# EasyEDA Pro project sfy3-v3.1.4.epro, schematic sfy3_1_2

## Sheets
1 Notecard, Antennas: Board Name: sfy3_1_2; Create Date: 2024-08-16
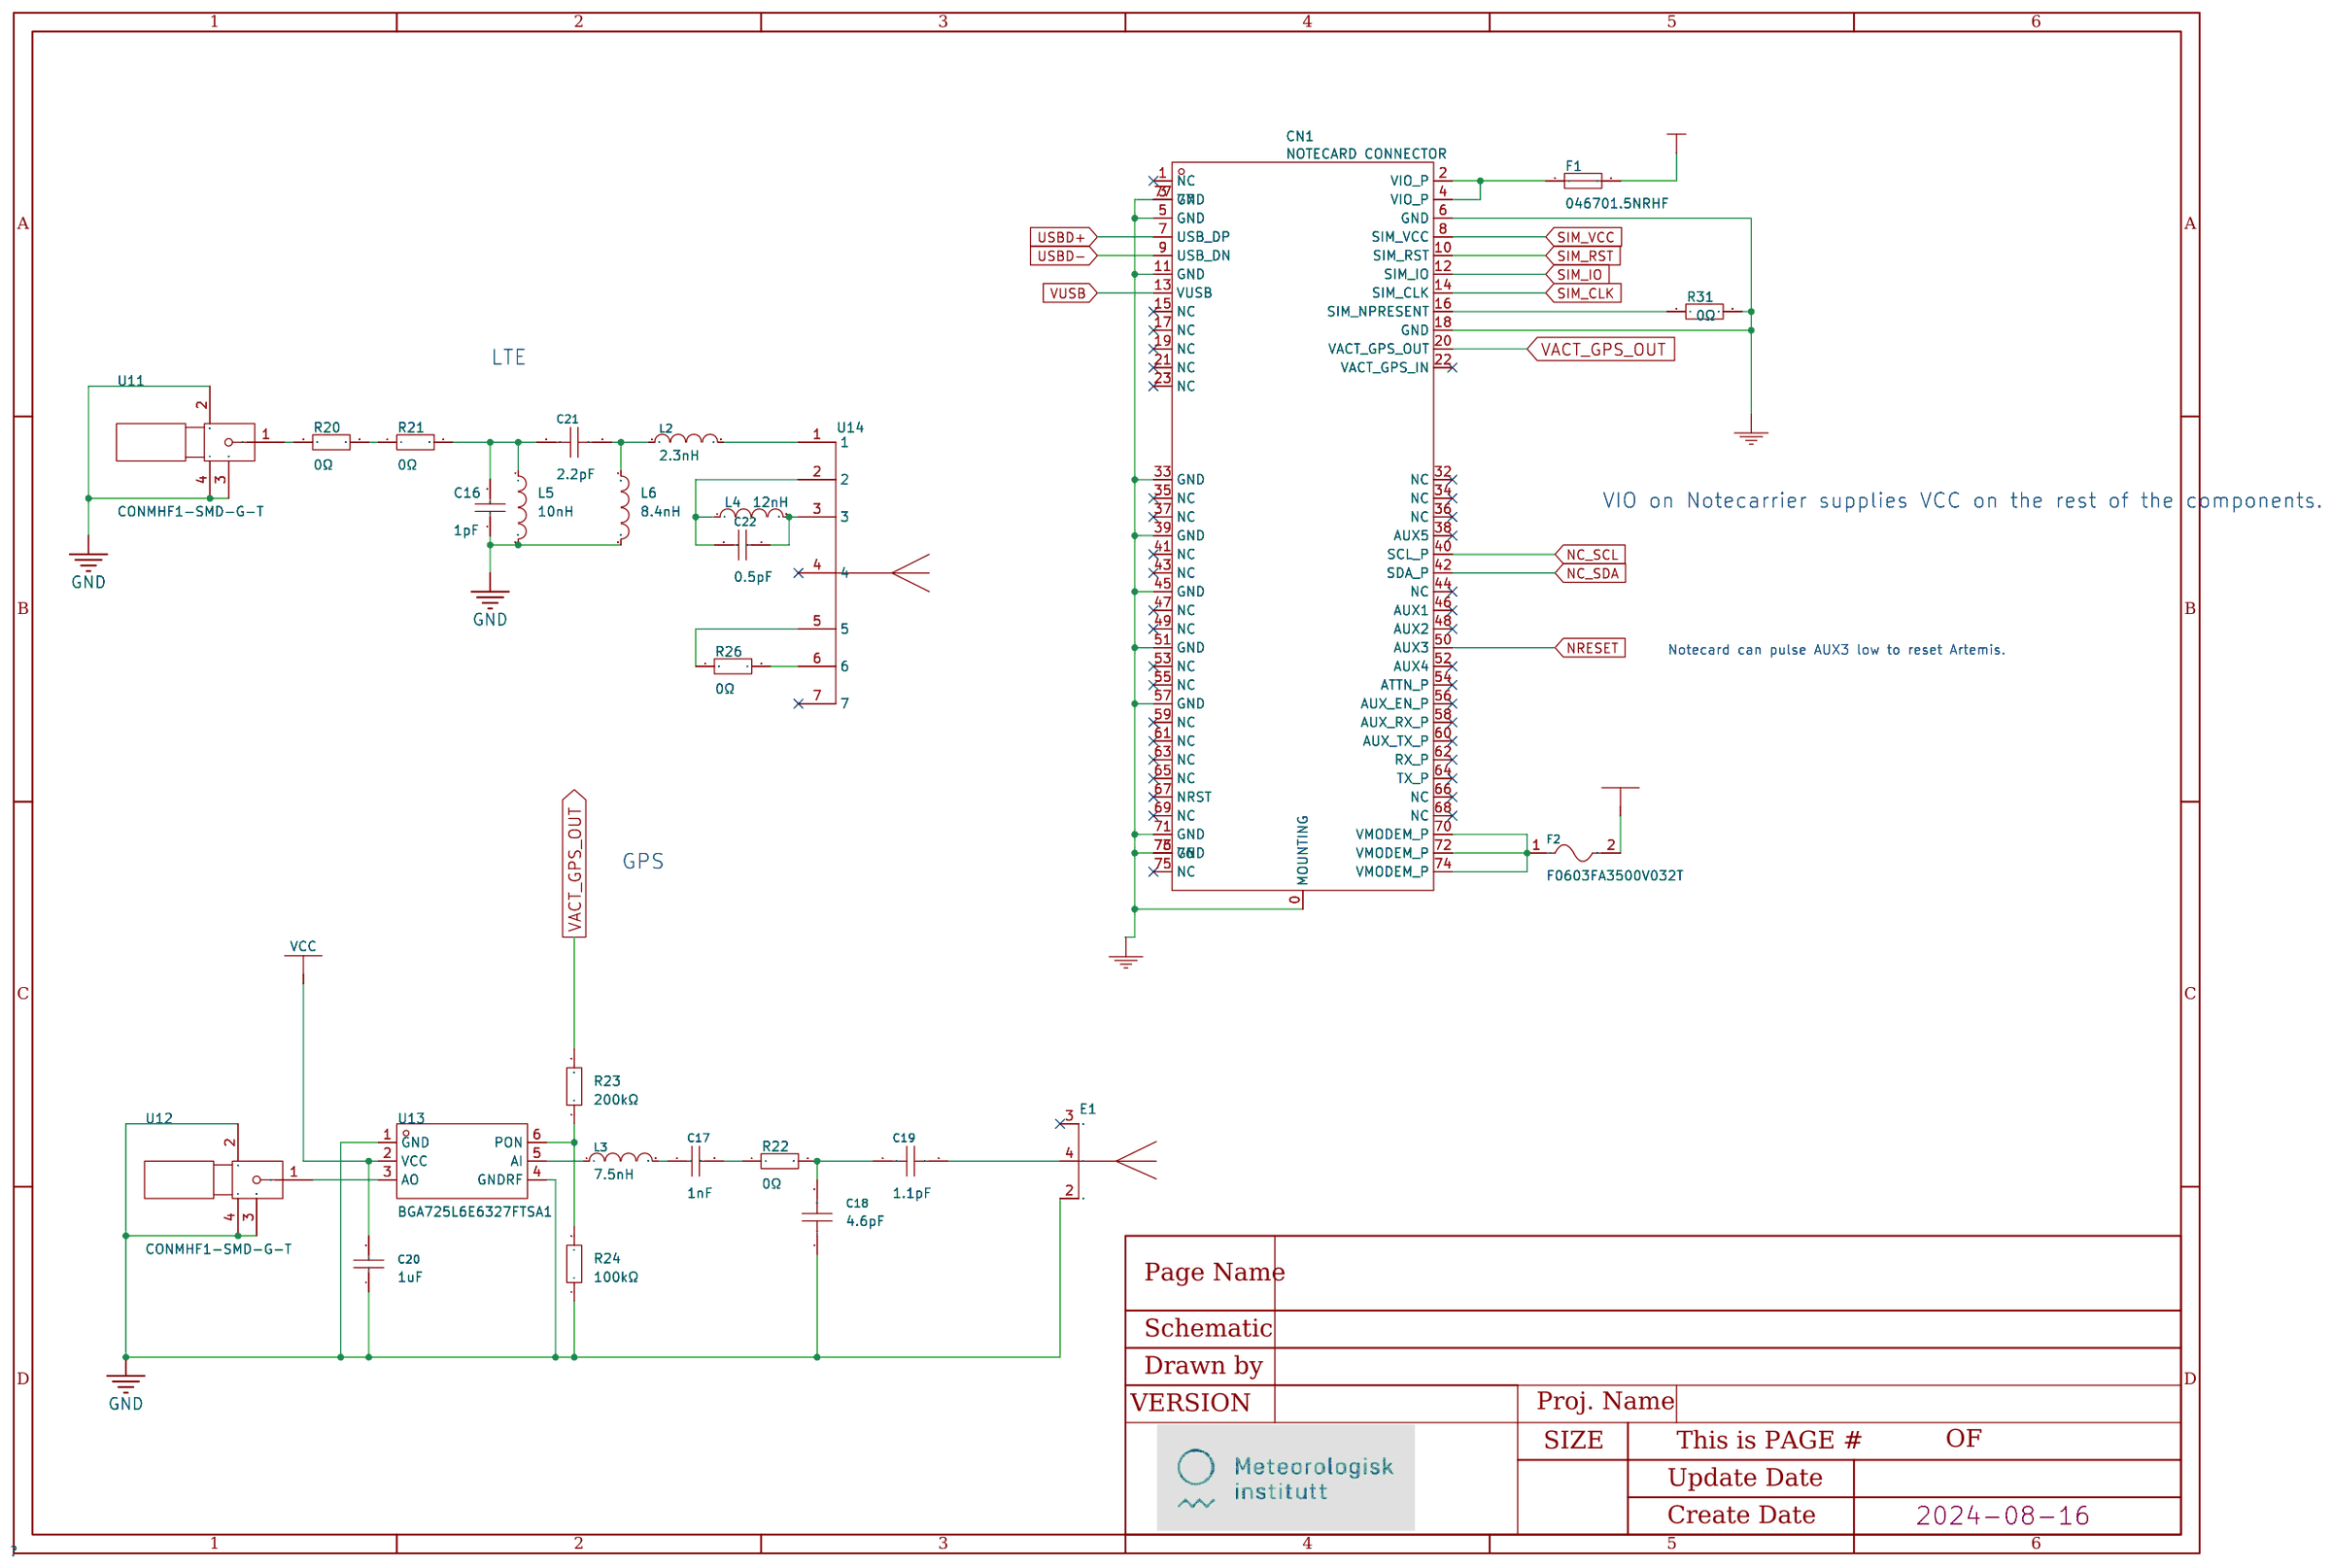
[diagram p10: Notecard, Antennas]
2 IMU, Thermistor, SD card: Page Name: IMU, Thermistor, SD card; Project Name: sfy3_2024-04-23; Schematic Name: sfy3_1_2; Update Date: 2025-01-31; Company: EasyEDA.com; Drawn: EasyEDA; Page Size: A4; Part Number: JLCPCB-002; Reviewed: EasyEDA; Version: V0.1
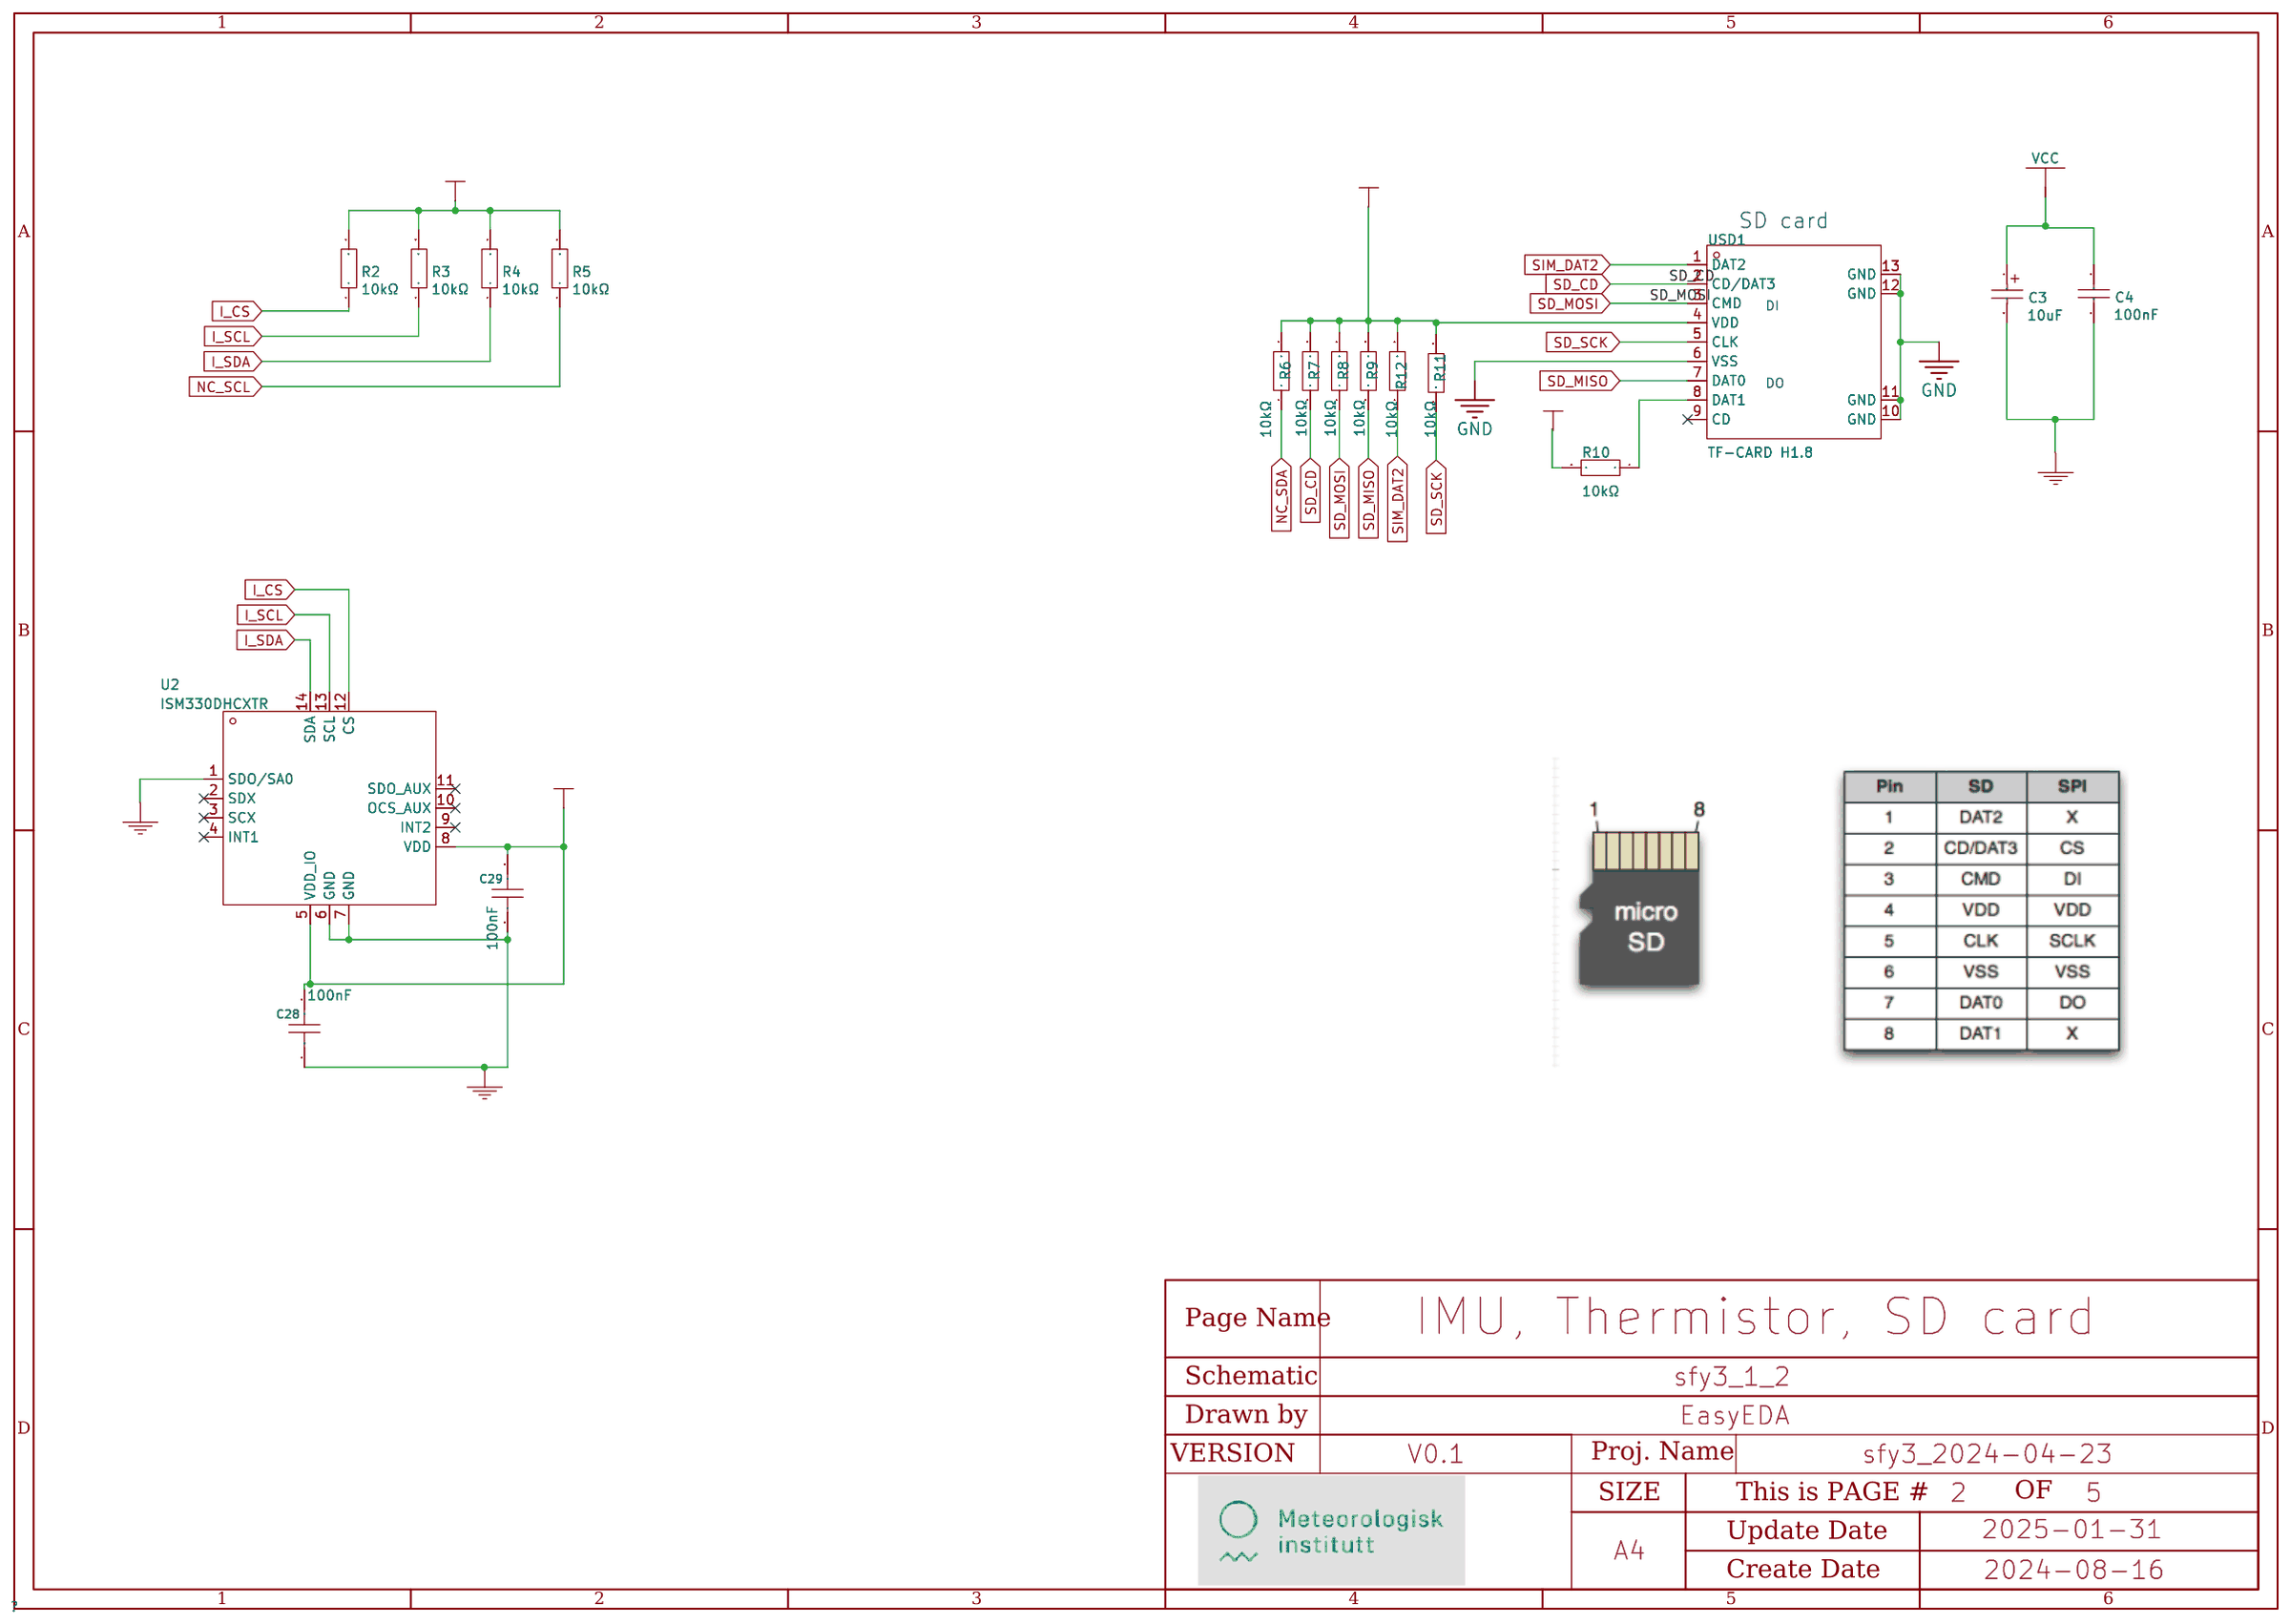
[diagram p11: IMU, Thermistor, SD card]
3 MCU (Artemis): Page Name: MCU (Artemis); Project Name: sfy3_2024-04-23; Schematic Name: sfy3_1_2; Update Date: 2025-01-31; Company: EasyEDA.com; Drawn: EasyEDA; Page Size: A4; Part Number: JLCPCB-002; Reviewed: EasyEDA; Version: V0.1
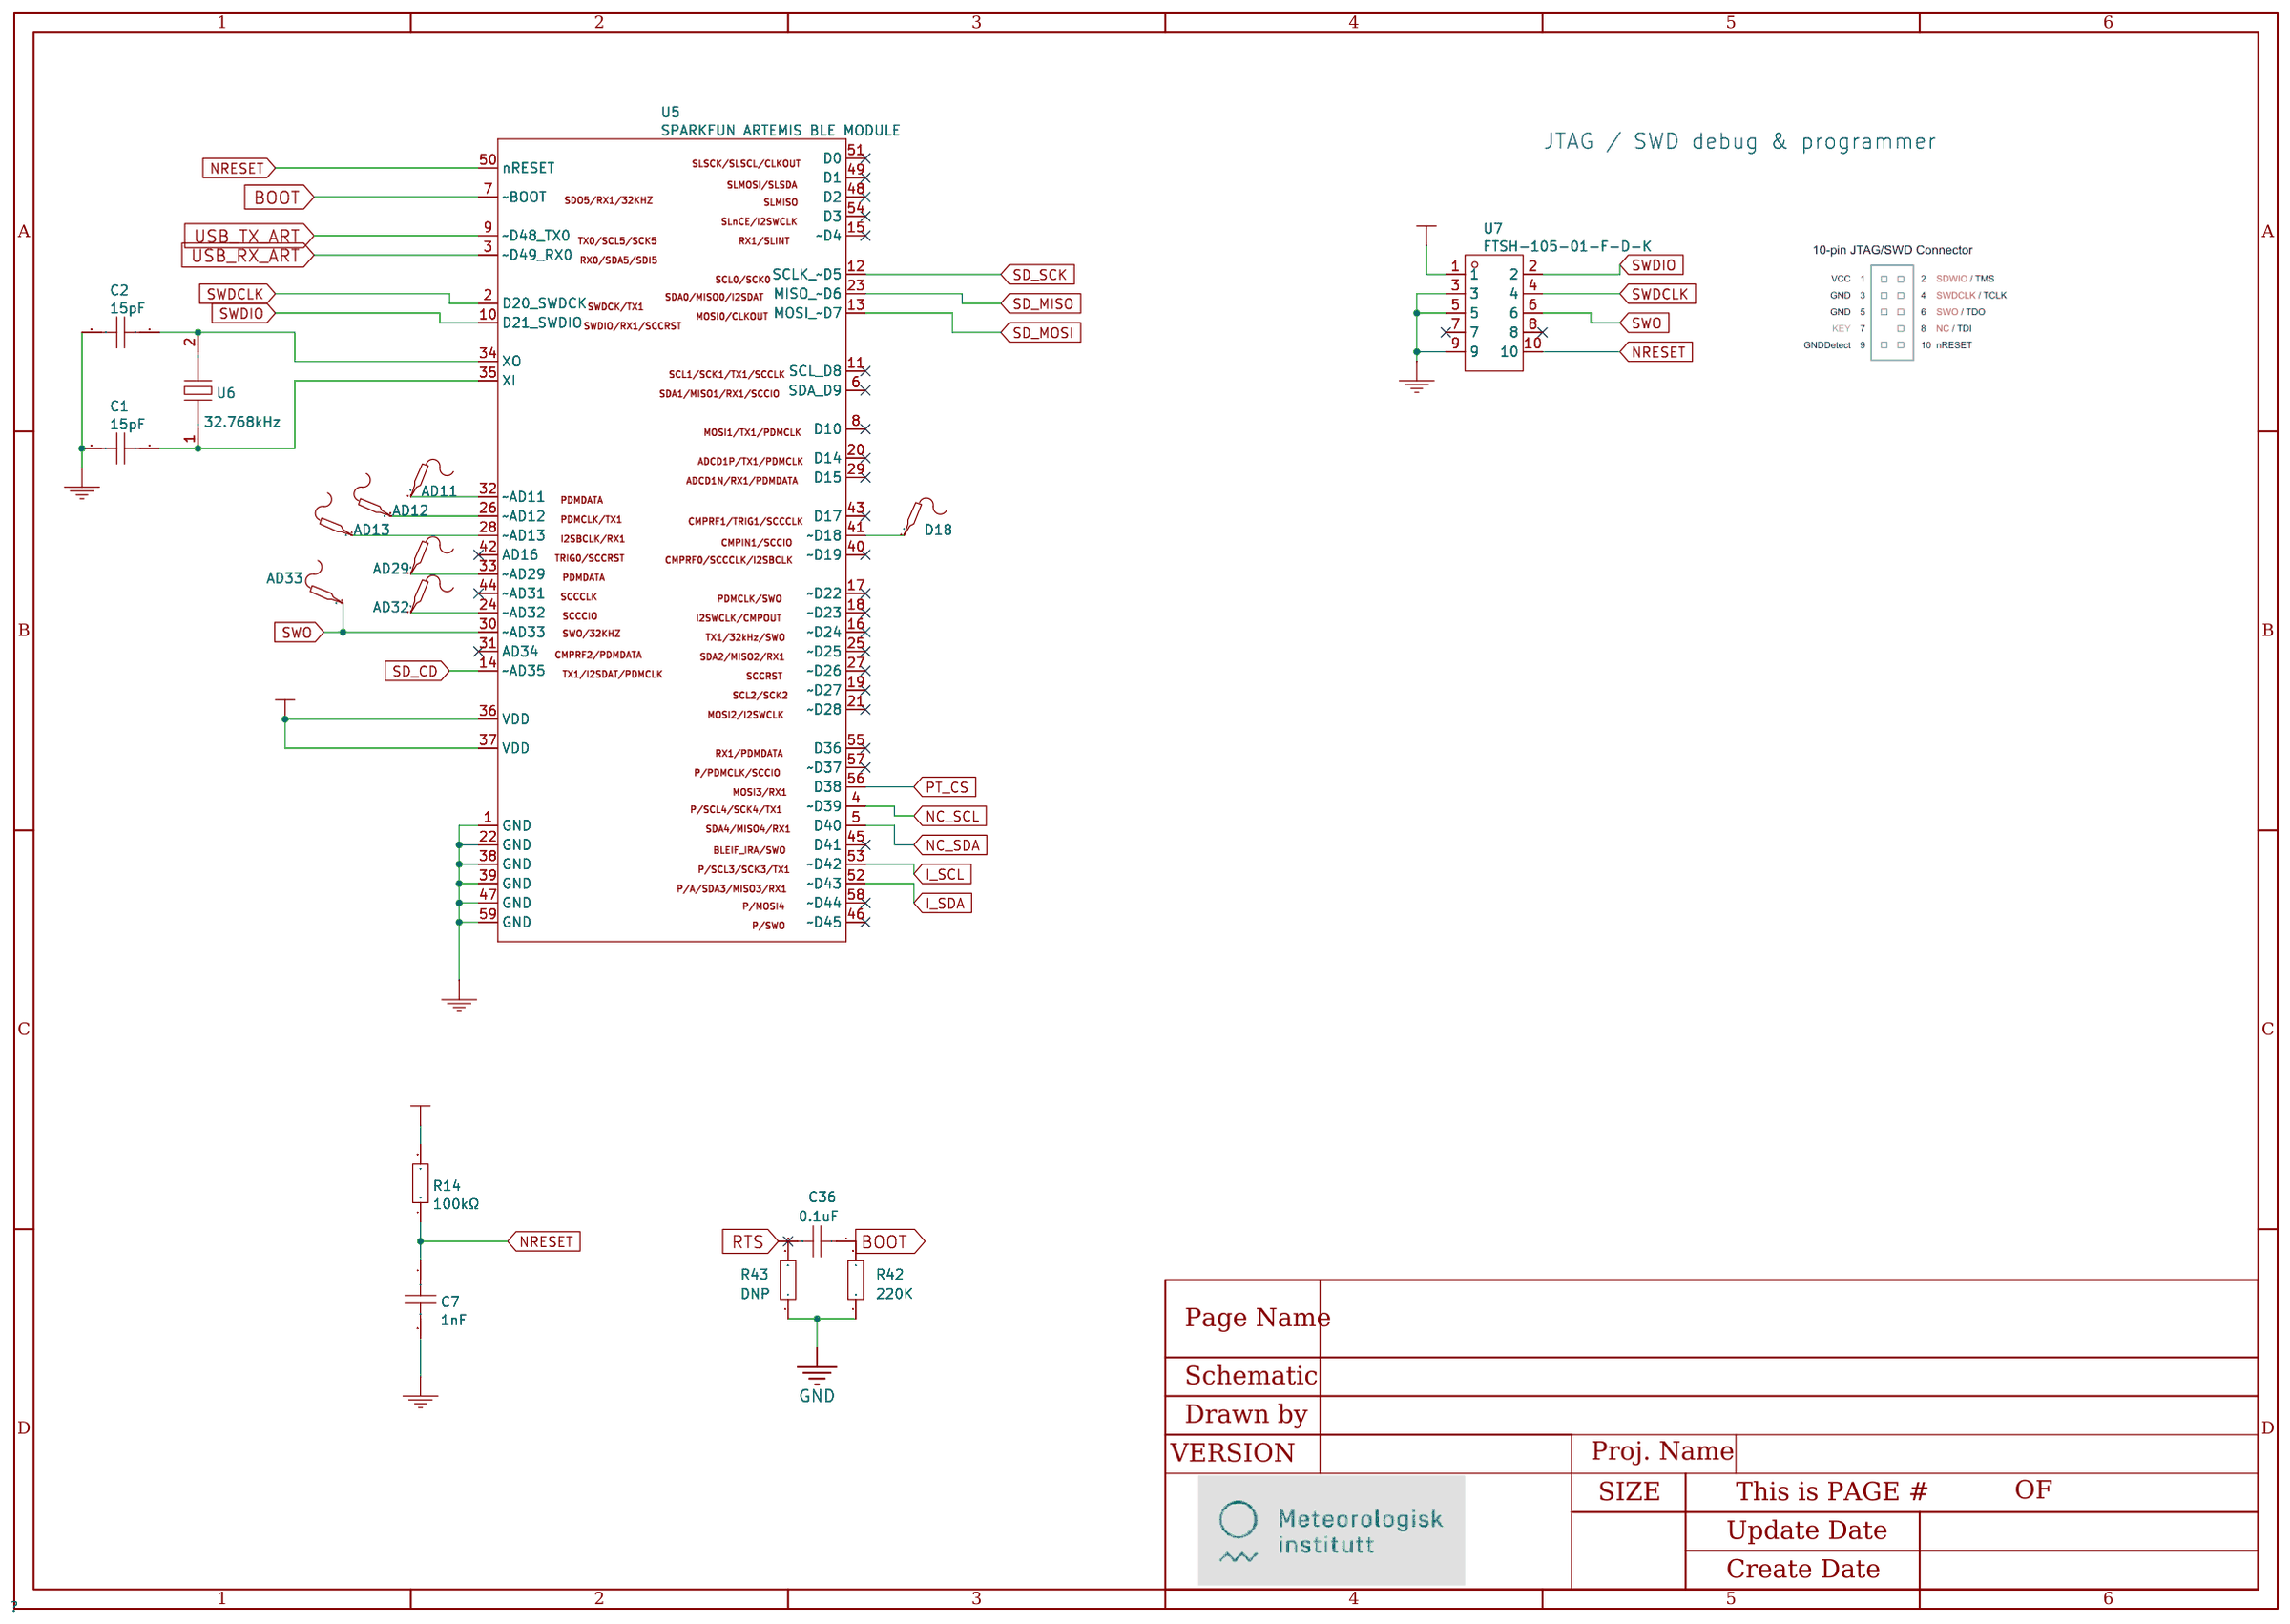
[diagram p12: MCU (Artemis)]
4 Power: Page Name: Power; Project Name: sfy3_2024-04-23; Schematic Name: sfy3_1_2; Update Date: 2025-04-09; Company: EasyEDA.com; Drawn: EasyEDA; Page Size: A4; Part Number: JLCPCB-002; Reviewed: EasyEDA; Version: V0.1
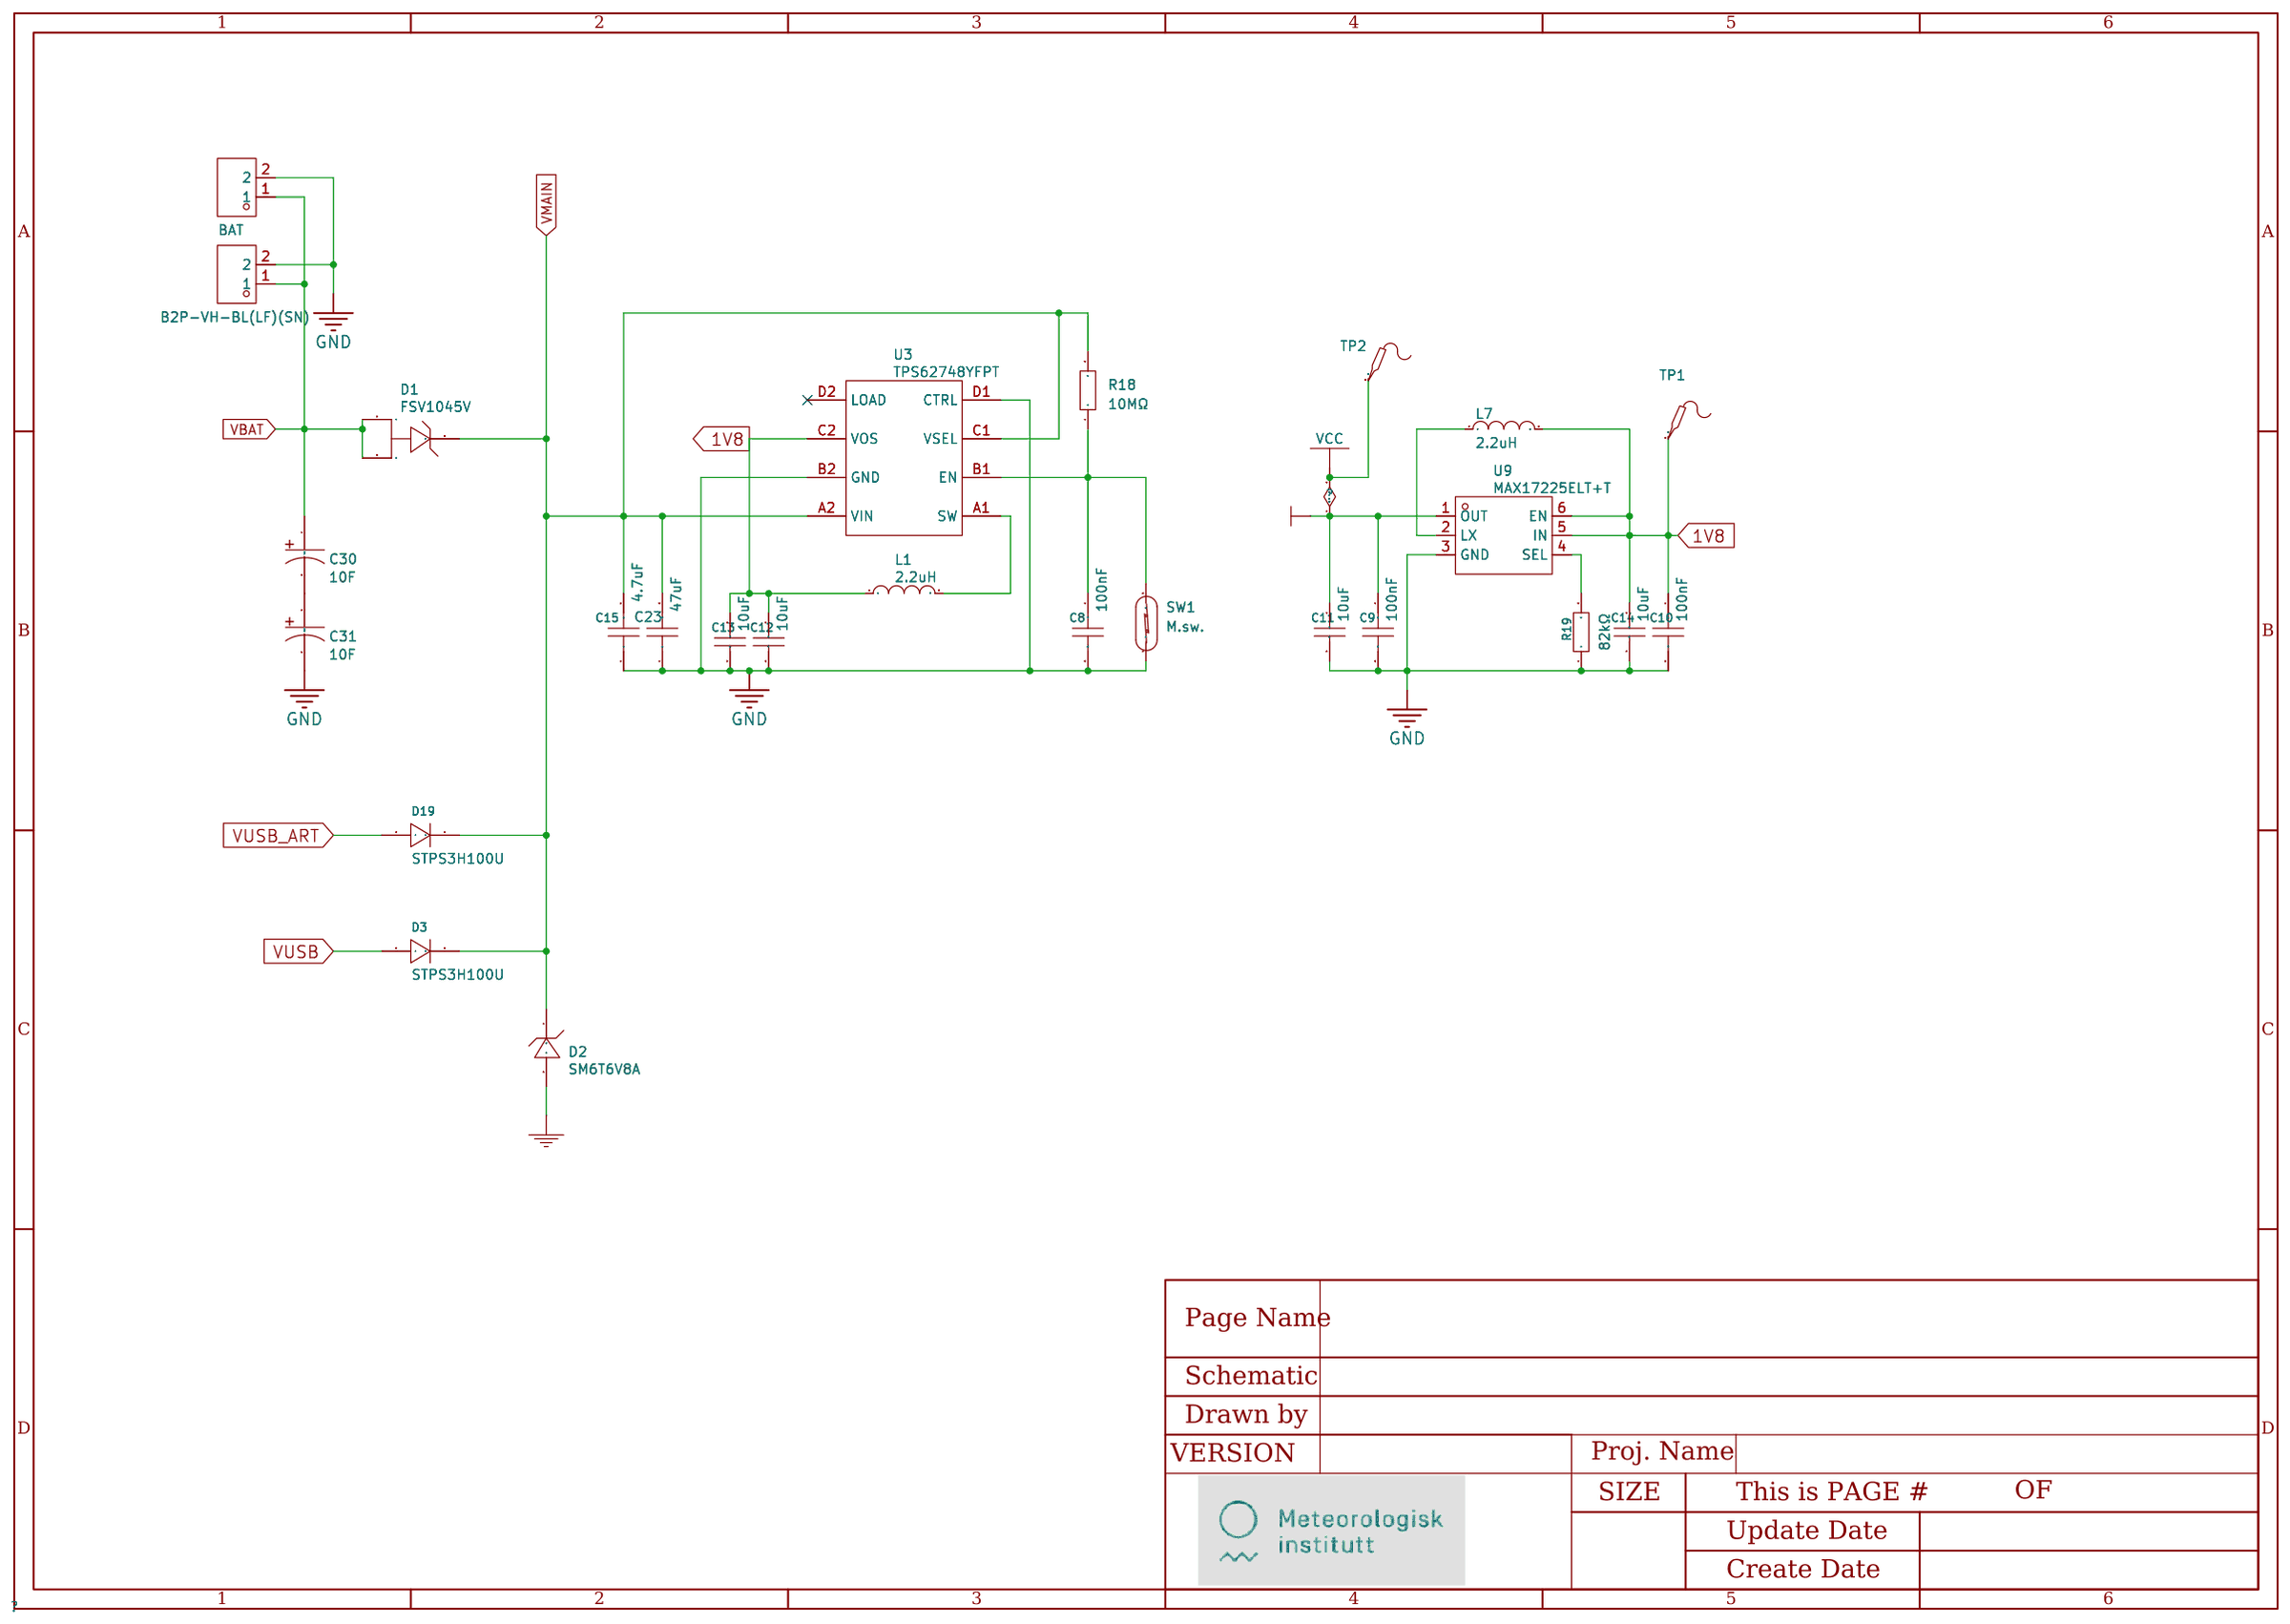
[diagram p13: Power]
5 USB, nSIM: Page Name: USB, nSIM; Project Name: sfy3_2024-04-23; Schematic Name: sfy3_1_2; Update Date: 2025-04-09; Company: EasyEDA.com; Drawn: EasyEDA; Page Size: A4; Part Number: JLCPCB-002; Reviewed: EasyEDA; Version: V0.1
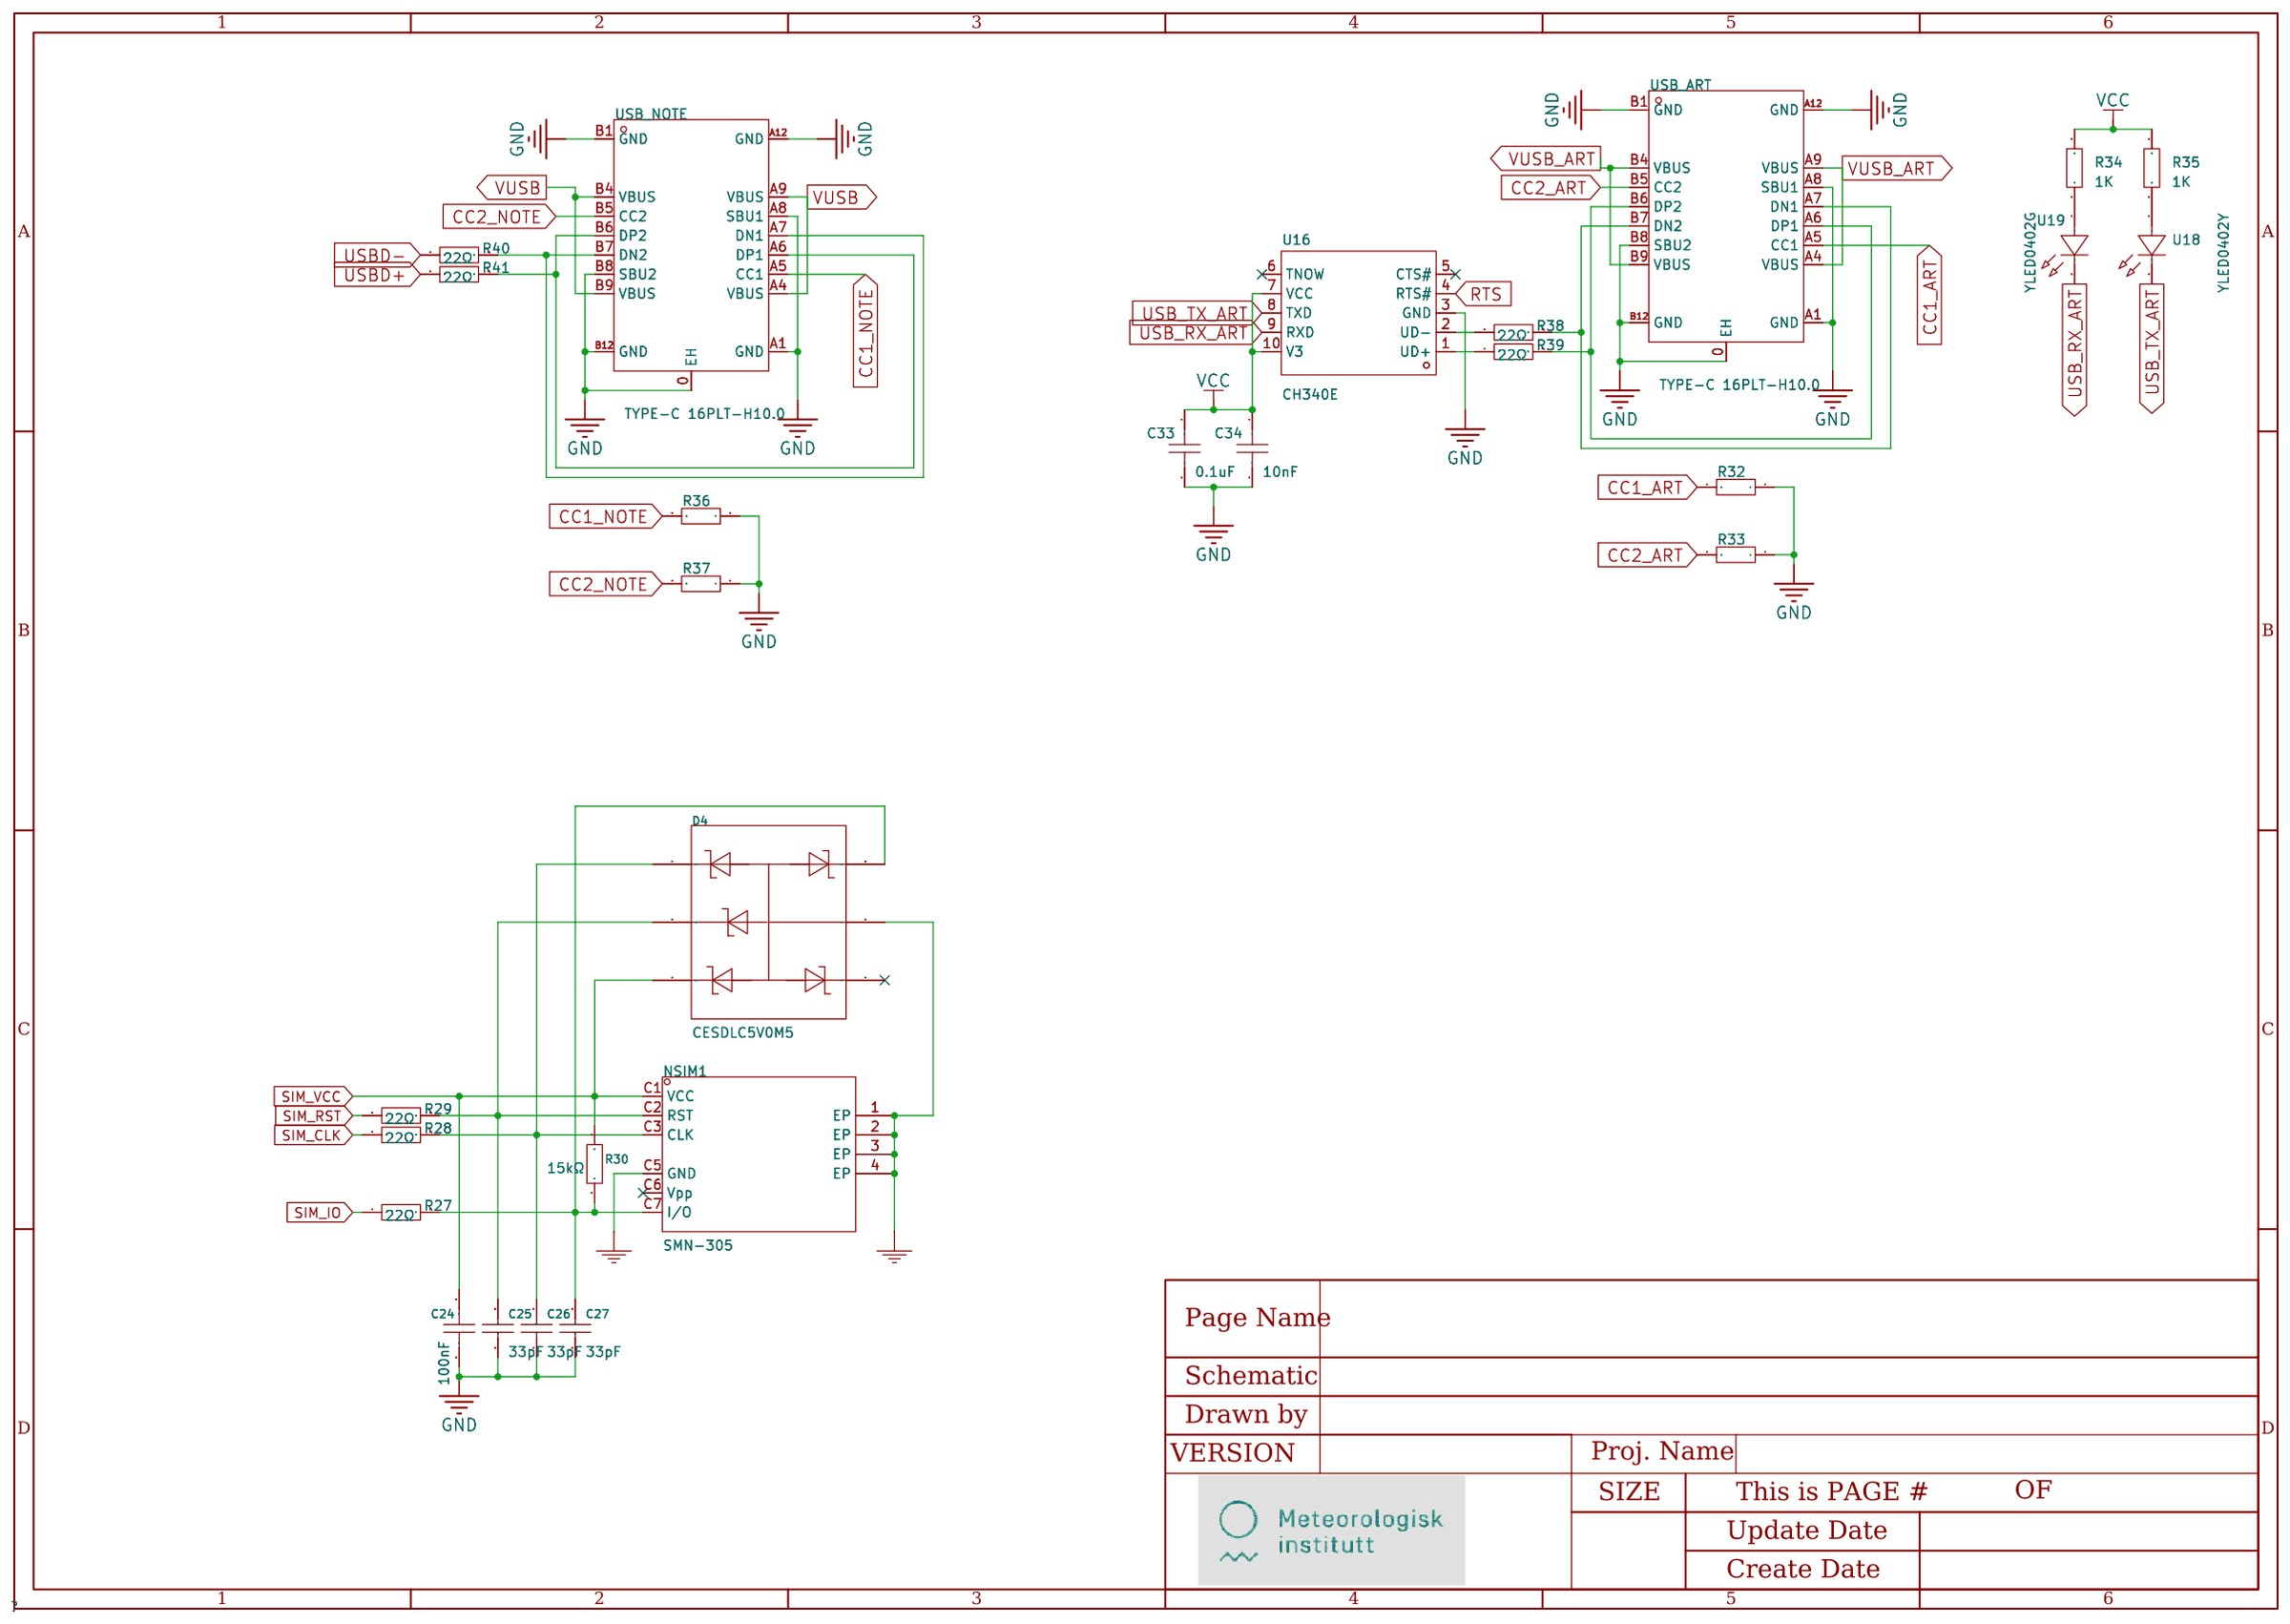
[diagram p14: USB, nSIM]

## Parts
sheet IMU, Thermistor, SD card
C3  10uF  [CAP-SMD_L3.2-W1.6-RD]
C4  100nF  [C0402]
C28  100nF  [C0402]
C29  100nF  [C0402]
R2  10kΩ  [R0402]
R3  10kΩ  [R0402]
R4  10kΩ  [R0402]
R5  10kΩ  [R0402]
R6  10kΩ  [R0402]
R7  10kΩ  [R0402]
R8  10kΩ  [R0402]
R9  10kΩ  [R0402]
R10  10kΩ  [R0402]
R11  10kΩ  [R0402]
R12  10kΩ  [R0402]
U2  ISM330DHCXTR  [LGA-14_L3.0-W2.5-P0.50-BR]
USD1  TF-CARD H1.8  [TF-SMD_TF-CARD-H1.8]
sheet MCU (Artemis)
AD11  -  [Test_Point1]  (no BOM)
AD12  -  [Test_Point1]  (no BOM)
AD13  -  [Test_Point1]  (no BOM)
AD29  -  [Test_Point1]
AD32  -  [Test_Point1]
AD33  -  [Test_Point1]  (no BOM)
C1  15pF  [C0402]
C2  15pF  [C0402]
C7  1nF  [C0402]
C36  0.1uF  [C0603]
D18  -  [Test_Point1]  (no BOM)
R14  100kΩ  [R0402]
R42  220K  [R0603]
R43  DNP  [R0603]  (no BOM)
U5  SPARKFUN ARTEMIS BLE MODULE  [ARTEMIS_BLE]
U6  32.768kHz  [CRYSTAL-SMD_L2.0-W1.2]
U7  FTSH-105-01-F-D-K  [CONN-TH_10P-P1.27_FTSH-105-01-F-D-K]  (no BOM)
sheet Notecard, Antennas
C16  1pF  [C0402]
C17  1nF  [C0402]
C18  4.6pF  [C0402]
C19  1.1pF  [C0402]
C20  1uF  [C0402]
C21  2.2pF  [C0402]
C22  0.5pF  [C0402]
CN1  NOTECARD CONNECTOR  [NOTECARD-ext]
E1  NN03-320  [NN03-320]
F1  046701.5NRHF  [F0603]
F2  F0603FA3500V032T  [F0603]
L2  2.3nH  [L0402]
L3  7.5nH  [IND-SMD_L1.0-W0.6]
L4  12nH  [L0603]
L5  10nH  [L0603]
L6  8.4nH  [IND-SMD_L1.0-W0.6]
R20  0Ω  [R0603]
R21  0Ω  [R0603]
R22  0Ω  [R0603]
R23  200kΩ  [R0402]
R24  100kΩ  [R0402]
R26  0Ω  [R0603]
R31  0Ω  [R0603]
U11  CONMHF1-SMD-G-T  [RF-SMD_CONMHF1-SMD-G-T]
U12  CONMHF1-SMD-G-T  [RF-SMD_CONMHF1-SMD-G-T]
U13  BGA725L6E6327FTSA1  [TSLP-6_L1.1-W0.7-P0.40-BR]
U14  -  [NN03-310-NoSilk]
sheet Power
BAT2  B2P-VH-BL(LF)(SN)  [CONN-TH-2P-P3.96_B2P-VH-BL-LF-SN]  (no BOM)
BAT5  BAT  [HDR-TH_2P-P2.54-V-M-1]  (no BOM)
C8  100nF  [C0402]
C9  100nF  [C0402]
C10  100nF  [C0402]
C11  10uF  [C0402]
C12  10uF  [C0402]
C13  10uF  [C0402]
C14  10uF  [C0402]
C15  4.7uF  [C0402]
C23  47uF  [C1206]
C30  10F  [CP_12.5X20MM]  (no BOM)
C31  10F  [CP_12.5X20MM]  (no BOM)
D1  FSV1045V  [TO-277A_L6.1-W4.6-P2.13-LS6.5-TR]
D2  SM6T6V8A  [SMB_L4.6-W3.6-LS5.3-RD]
D3  STPS3H100U  [SMB_L4.6-W3.6-LS5.3-RD]
D19  STPS3H100U  [SMB_L4.6-W3.6-LS5.3-RD]
L1  2.2uH  [L0806]
L7  2.2uH  [IND-SMD_L4.0-W4.0_XAL4040-103]
R18  10MΩ  [R0402]
R19  82kΩ  [R0402]
SW1  M.sw.  [2P]  (no BOM)
TP1  -  [TESTPOINT-1MM]  (no BOM)
TP2  -  [Test-Point-0.5mm]
U3  TPS62748YFPT  [DSBGA-8_L1.6-W0.9-R2-C4-P0.40-BL]
U9  MAX17225ELT+T  [UDFN-6_L2.0-W2.0-P0.65-BL]
sheet USB, nSIM
C24  100nF  [C0402]
C25  33pF  [C0402]
C26  33pF  [C0402]
C27  33pF  [C0402]
C33  0.1uF  [C0603]
C34  10nF  [C0603]
D4  CESDLC5V0M5  [SOT-563_L1.6-W1.2-P0.50-LS1.6-BR]
NSIM1  SMN-305  [SIM-SMD_SMN-305]
R27  22Ω  [R0402]
R28  22Ω  [R0402]
R29  22Ω  [R0402]
R30  15kΩ  [R0402]
R32  5.1kΩ  [R0402]
R33  5.1kΩ  [R0402]
R34  1K  [R0402]
R35  1K  [R0402]
R36  5.1kΩ  [R0402]
R37  5.1kΩ  [R0402]
R38  22Ω  [R0402]
R39  22Ω  [R0402]
R40  22Ω  [R0402]
R41  22Ω  [R0402]
U16  CH340E  [MSOP-10_L3.0-W3.0-P0.50-LS5.0-BL]
U18  YLED0402Y  [LED0402-R-RD]
U19  YLED0402G  [LED0402-R-RD]
USB_ART  TYPE-C 16PLT-H10.0  [TYPE-C-SMD_USB4120-03-C]
USB_NOTE  TYPE-C 16PLT-H10.0  [TYPE-C-SMD_USB4120-03-C]

## Library data of the parts
C3 = 10uF: Supplier: LCSC; Manufacturer: Sunlord; Manufacturer Part: TC212A106M010B; Supplier Part: C124849; JLCPCB Part Class: Extended Part
C4 C8-C10 C24 C28 C29 = CC0402KRX7R7BB104: Capacitance: Tolerance:±10% Tolerance:±10% Voltage Rated: Temperature Coefficient:; LCSC Part Name: 100nF ±10% 16V; Supplier Part: C60474; Manufacturer: YAGEO(国巨); Supplier Footprint: 0402; JLCPCB Part Class: Extended Part; Datasheet: https://atta.szlcsc.com/upload/public/pdf/source/20211223/9278FD768280B81DDBEF48FA36411A03.pdf; Supplier: LCSC; Tolerance: ±10%
R2-R12 = 0402WGF1002TCE: Type:Thick Film Resistors Resistance:10kΩ Tolerance:±1% Tolerance:±1% Power(Watts): Overload Voltage (Max): Temperature Coefficient:±100ppm/℃ Temperature Coefficient:±100ppm/℃ Operating Temperature Range:-55℃~+155℃ Operating Temperature Range:-55℃~+155℃; LCSC Part Name: 10kΩ ±1% 62.5mW 厚膜电阻; Supplier Part: C25744; Manufacturer: UNI-ROYAL(厚声); Supplier Footprint: 0402; JLCPCB Part Class: Basic Part; Datasheet: https://atta.szlcsc.com/upload/public/pdf/source/20200306/C422600_1E6D84923E4A46A82E41ADD87F860B5C.pdf; Supplier: LCSC; Type: Thick Film Resistors; Tolerance: ±1%; Temperature Coefficient: ±100ppm/℃; Operating Temperature Range: -55℃~+155℃
U2 = ISM330DHCXTR: Supplier: LCSC; Supplier Part: C2655101; Manufacturer: ST(意法半导体); JLCPCB Part Class: Extended Part
USD1 = TF-CARD H1.8: Card Connection Mode:Self bomb Card Type:MicroSD卡(TF卡) Connector Type:Deck Maximum Body Height:1.8mm Contact Material:Copper Alloy Contact Plating:Gold Operating Temperature Range:-40℃~+70℃ Operating Temperature Range:-40℃~+70℃; LCSC Part Name: 自弹式 MicroSD卡(TF卡) 卡座; Supplier Part: C7529389; Manufacturer: SHOU HAN(首韩); Supplier Footprint: SMD; JLCPCB Part Class: Extended Part; Datasheet: https://atta.szlcsc.com/upload/public/pdf/source/20230818/611DB5E7B45C91025B0B37F957961A64.pdf; Supplier: LCSC; Card Connection Mode: Self bomb; Card Type: MicroSD卡(TF卡); Connector Type: Deck; Maximum Body Height: 1.8mm; Contact Material: Copper Alloy; Contact Plating: Gold; Operating Temperature Range: -40℃~+70℃
AD11-AD13 AD29 AD32 AD33 D18 TP1 TP2 = Test-Point: Test Point 测试点
C1 C2 = 15pF: Supplier: LCSC; Supplier Part: C325460; Manufacturer: YAGEO(国巨); Manufacturer Part: CC0402GRNPO9BN150; JLCPCB Part Class: Extended Part
C7 C17 = CC0402KRX7R9BB102: Capacitance: Tolerance:±10% Tolerance:±10% Voltage Rated: Temperature Coefficient:; LCSC Part Name: 1nF ±10% 50V; Supplier Part: C106205; Manufacturer: YAGEO(国巨); Supplier Footprint: 0402; JLCPCB Part Class: Extended Part; Datasheet: https://atta.szlcsc.com/upload/public/pdf/source/20181008/C309510_22F155564471FAF6A489F7D68F34234E.pdf; Supplier: LCSC; Tolerance: ±10%
C33 C34 C36 = CAP_0603: Supplier Footprint: 0603
R14 R24 = RC0402FR-07100KL: Type:Thick Film Resistors Resistance: Tolerance:±1% Tolerance:±1% Power(Watts): Overload Voltage (Max): Temperature Coefficient:±100ppm/℃ Temperature Coefficient:±100ppm/℃ Operating Temperature Range:-55℃~+155℃ Operating Temperature Range:-55℃~+155℃; LCSC Part Name: 厚膜电阻 100kΩ ±1% 62.5mW; Supplier Part: C60491; Manufacturer: YAGEO(国巨); Supplier Footprint: 0402; JLCPCB Part Class: Extended Part; Datasheet: https://atta.szlcsc.com/upload/public/pdf/source/20180927/C295883_E8D83085EA81BD7DE0B2B681138C15EE.pdf; Supplier: LCSC; Type: Thick Film Resistors; Tolerance: ±1%; Temperature Coefficient: ±100ppm/℃; Operating Temperature Range: -55℃~+155℃
R34 R35 R42 R43 = Res_0603: Supplier Footprint: 0603
U5 = SPARKFUN ARTEMIS BLE MODULE: Manufacturer: SPARKFUN; Manufacturer Part: WRL-15484; Supplier: Sparkfun; Supplier Part: WRL-15484; link: https://www.sparkfun.com/products/15484
U6 = 32.768kHz: Supplier: LCSC; Supplier Part: C5341285; Manufacturer: Micro Crystal(瑞士微晶); Manufacturer Part: CM8V-T1A-32.768KHZ-12.5PF-20PPM-TA-QC; JLCPCB Part Class: Extended Part
U7 = FTSH-105-01-F-D-K: Supplier: LCSC; Supplier Part: C9900011230; Manufacturer: null; JLCPCB Part Class: Extended Part
C16 = GJM1555C1H1R0WB01D: Capacitance: Voltage Rated: Temperature Coefficient:; LCSC Part Name: 1pF 50V ±0.05pF; Supplier Part: C72134; Manufacturer: muRata(村田); Supplier Footprint: 0402; JLCPCB Part Class: Extended Part; Datasheet: https://atta.szlcsc.com/upload/public/pdf/source/20161108/1478586454732.pdf; Supplier: LCSC
C18 = CBR04C469B5GAC: Capacitance: Voltage Rated: Temperature Coefficient:; LCSC Part Name: 4.6pF 50V; Supplier Part: C600260; Manufacturer: KEMET(基美); Supplier Footprint: 0402; JLCPCB Part Class: Extended Part; Datasheet: https://atta.szlcsc.com/upload/public/pdf/source/20200414/C513330_C9B0C839AB42DCB65FF29F8BB4398565.pdf; Supplier: LCSC
C19 = GJM1555C1H1R1WB01D: Capacitance: Voltage Rated: Temperature Coefficient:; LCSC Part Name: 1.1pF 50V; Supplier Part: C88879; Manufacturer: muRata(村田); Supplier Footprint: 0402; JLCPCB Part Class: Extended Part; Datasheet: https://atta.szlcsc.com/upload/public/pdf/source/20190904/C426118_85E81C7C1F21FC87C5FB6D536E0847B4.pdf; Supplier: LCSC
C20 = CL05A105KO5NNNC: Capacitance: Tolerance:±10% Tolerance:±10% Voltage Rated: Temperature Coefficient:; LCSC Part Name: 1uF ±10% 16V; Supplier Part: C29266; Manufacturer: SAMSUNG(三星); Supplier Footprint: 0402; JLCPCB Part Class: Extended Part; Datasheet: https://atta.szlcsc.com/upload/public/pdf/source/20160218/1457707763339.pdf; Supplier: LCSC; Tolerance: ±10%
C21 = GJM1555C1H2R2WB01D: Capacitance: Voltage Rated: Temperature Coefficient:; LCSC Part Name: 2.2pF 50V; Supplier Part: C88887; Manufacturer: muRata(村田); Supplier Footprint: 0402; JLCPCB Part Class: Extended Part; Datasheet: https://atta.szlcsc.com/upload/public/pdf/source/20190904/C426118_85E81C7C1F21FC87C5FB6D536E0847B4.pdf; Supplier: LCSC
C22 = GJM1555C1HR50WB01D: Capacitance: Voltage Rated: Temperature Coefficient:; LCSC Part Name: 0.5pF 50V; Supplier Part: C76912; Manufacturer: muRata(村田); Supplier Footprint: 0402; JLCPCB Part Class: Extended Part; Datasheet: https://atta.szlcsc.com/upload/public/pdf/source/20180307/C76912_15204090800731407702.pdf; Supplier: LCSC
CN1 = NOTECARD CONNECTOR: Supplier: LCSC; Supplier Part: C2761457; Manufacturer: FOXCONN(富士康); Manufacturer Part: AS0BC21-S48BE-7H; JLCPCB Part Class: Extended Part
E1 = NN03-320: Manufacturer: Fractus Antennas S.L.; Manufacturer Part: C9900018569
F1 = 046701.5NRHF: Type:SMD Fuse Current Rating:1.5A Voltage Rating  (AC):32V Voltage Rating (DC):65V Operating Temperature:-55℃~+90℃ Operating Temperature:-55℃~+90℃ Breaking Capacity:35A；35A; LCSC Part Name: 32V贴片式保险丝; Supplier Part: C187608; Manufacturer: Littelfuse(美国力特); Supplier Footprint: 0603; JLCPCB Part Class: Extended Part; Datasheet: https://atta.szlcsc.com/upload/public/pdf/source/20180709/C206991_1939A2B48204B5461A655B76CD87198D.pdf; Supplier: LCSC; Type: SMD Fuse; Current Rating: 1.5A; Voltage Rating  (AC): 32V; Voltage Rating (DC): 65V; Operating Temperature: -55℃~+90℃; Breaking Capacity: 35A；35A
F2 = F0603FA3500V032T: Type:SMD Fuse Current Rating:3.5A Voltage Rating (DC):32V Operating Temperature:-55℃~+125℃ Operating Temperature:-55℃~+125℃ Breaking Capacity:35A; LCSC Part Name: 贴片式陶瓷保险丝; Supplier Part: C96545; Manufacturer: AEM; Supplier Footprint: 0603; JLCPCB Part Class: Extended Part; Datasheet: https://atta.szlcsc.com/upload/public/pdf/source/20170225/1488010668504.pdf; Supplier: LCSC; Type: SMD Fuse; Current Rating: 3.5A; Voltage Rating (DC): 32V; Operating Temperature: -55℃~+125℃; Breaking Capacity: 35A
L2 = LQW15AN2N3G80D: Inductance:2.3nH Tolerance:±2% Tolerance:±2% Rated Current: Saturation Current (Isat):- DC Resistance (DCR): Ratings:-; LCSC Part Name: 2.3nH ±2%; Supplier Part: C412265; Manufacturer: muRata(村田); Supplier Footprint: 0402; JLCPCB Part Class: Extended Part; Datasheet: https://atta.szlcsc.com/upload/public/pdf/source/20200107/C471381_7218EE88923040382E3940C2181C6210.pdf; Supplier: LCSC; Tolerance: ±2%
L3 = LQW15AN7N5H00D: Inductance:7.5nH Tolerance:±3% Tolerance:±3% Rated Current: Saturation Current (Isat):- DC Resistance (DCR): Ratings:-; LCSC Part Name: 7.5nH ±3%; Supplier Part: C397303; Manufacturer: muRata(村田); Supplier Footprint: 0402; JLCPCB Part Class: Extended Part; Datasheet: https://atta.szlcsc.com/upload/public/pdf/source/20191016/C437364_463D6516B3BAE72B1DA0754F3D9B8308.pdf; Supplier: LCSC; Tolerance: ±3%
L4 = L_0603
L5 = L_0603: LQW18AN12NG80D
L6 = LQW15AN8N4C10D: Inductance:8.4nH Rated Current: Saturation Current (Isat):- DC Resistance (DCR): Ratings:-; Supplier Part: C412364; Manufacturer: muRata(村田); Supplier Footprint: 0402; JLCPCB Part Class: Extended Part; Datasheet: https://atta.szlcsc.com/upload/public/pdf/source/20190819/C412364_41B3E58452553B6FF5223FC46CB48E7D.pdf; Supplier: LCSC
R20-R22 R26 R31 = RC0603JR-070RL: Type:Thick Film Resistors Resistance: Tolerance:±5% Tolerance:±5% Power(Watts): Overload Voltage (Max): Operating Temperature Range:-55℃~+155℃ Operating Temperature Range:-55℃~+155℃; LCSC Part Name: 厚膜电阻 0Ω ±5% 100mW; Supplier Part: C95177; Manufacturer: YAGEO(国巨); Supplier Footprint: 0603; JLCPCB Part Class: Extended Part; Datasheet: https://atta.szlcsc.com/upload/public/pdf/source/20170818/C126805_1503051298841895366.pdf; Supplier: LCSC; Type: Thick Film Resistors; Tolerance: ±5%; Operating Temperature Range: -55℃~+155℃
R23 = RC0402FR-07200KL: Type:Thick Film Resistors Resistance: Tolerance:±1% Tolerance:±1% Power(Watts): Overload Voltage (Max): Temperature Coefficient:±100ppm/℃ Temperature Coefficient:±100ppm/℃ Operating Temperature Range:-55℃~+155℃ Operating Temperature Range:-55℃~+155℃; LCSC Part Name: 厚膜电阻 200kΩ ±1% 62.5mW; Supplier Part: C114763; Manufacturer: YAGEO(国巨); Supplier Footprint: 0402; JLCPCB Part Class: Extended Part; Datasheet: https://atta.szlcsc.com/upload/public/pdf/source/20180821/C275644_0D56F95EFF785E7D9A1FEF436B37DA78.pdf; Supplier: LCSC; Type: Thick Film Resistors; Tolerance: ±1%; Temperature Coefficient: ±100ppm/℃; Operating Temperature Range: -55℃~+155℃
U11 U12 = CONMHF1-SMD-G-T: Connector Type:板端 Number of Ports:1 Frequency-Max:6GHz RF Series:IPEX Impedance:50Ω Contact Material:Copper Alloy Contact Plating:Gold Operating Temperature Range:-65℃~+165℃ Operating Temperature Range:-65℃~+165℃; LCSC Part Name: IPEX; Supplier Part: C3174614; Manufacturer: Linx; JLCPCB Part Class: Extended Part; Supplier: LCSC; Connector Type: 板端; Number of Ports: 1; Frequency-Max: 6GHz; RF Series: IPEX; Impedance: 50Ω; Contact Material: Copper Alloy; Contact Plating: Gold; Operating Temperature Range: -65℃~+165℃
U13 = BGA725L6E6327FTSA1: Applications:GPS,GNSS Frequency Range:1.55GHz~1.615GHz Frequency Range:1.55GHz~1.615GHz Gain:20dB Noise Figure:0.65dB Supply Voltage:1.5V~3.6V Supply Voltage:1.5V~3.6V Supply Current:3.6mA; Supplier Part: C2649466; Manufacturer: Infineon(英飞凌); Supplier Footprint: DFN-6(0.7x1.1); JLCPCB Part Class: Extended Part; Datasheet: https://atta.szlcsc.com/upload/public/pdf/source/20211206/2E6B0317A65C39FEDF5554E21B6728AE.pdf; Supplier: LCSC; Applications: GPS,GNSS; Frequency Range: 1.55GHz~1.615GHz; Gain: 20dB; Noise Figure: 0.65dB; Supply Voltage: 1.5V~3.6V; Supply Current: 3.6mA
U14 = NN03-310
BAT2 = B2P-VH-BL(LF)(SN): Pins Structure:1x2P Pitch:3.96mm Mounting Style:Direct Insert Reference Series:VH Number of Pins:2P Number of Rows:1 Number of PINs Per Row:2 Row Spacing:- Current Rating (Max):10A Contact Material:Brass Contact Plating:Tin Operating Temperature Range:-25; LCSC Part Name: 1x2P 间距:3.96mm 直插 系列:VH; Supplier Part: C274411; Manufacturer: JST; Supplier Footprint: 插件,P=3.96mm; JLCPCB Part Class: Extended Part; Datasheet: https://atta.szlcsc.com/upload/public/pdf/source/20180919/C274412_5958B93FF2764E403A5EC0D31BFCA574.pdf; Supplier: LCSC; Pins Structure: 1x2P; Pitch: 3.96mm; Mounting Style: Direct Insert; Reference Series: VH; Number of Pins: 2P; Number of Rows: 1; Number of PINs Per Row: 2; Current Rating (Max): 10A; Contact Material: Brass; Contact Plating: Tin; Operating Temperature Range: -25℃~+85℃; Rated Voltage (Max): 250V; Plastic Material: Glass Fiber Reinforced PBT; Flame Retardant Rating: UL94V-0; Colour: Blue; Z-Height of the Board: 9.4mm; X-Length of Bottom Edge on Board (Spacing Line): 7.86mm; Y-Width of Bottom Edge on Board: 8.5mm
BAT5 = 22284020: Pin Structure:1x2P Pitch:2.54mm Row Spacing:- Circluar Pins/Square Pins:Square Pins Mounting Type:Straight Number of Rows:Plugin Number of Pins:2P Current Rating (Max):- Voltage Rating (Max):- Length of Mating Pin:- Insulation Height:- Contact Material: C; LCSC Part Name: 间距:2.54mm 1x2P 直插 方针; Supplier Part: C234182; Manufacturer: MOLEX; Supplier Footprint: 插件,P=2.54mm; JLCPCB Part Class: Extended Part; Datasheet: https://atta.szlcsc.com/upload/public/pdf/source/20180801/C234182_F77B1C2A9EF8AC9B34CEB7670B45930E.pdf; Supplier: LCSC; Pin Structure: 1x2P; Pitch: 2.54mm; Circluar Pins/Square Pins: Square Pins; Mounting Type: Straight; Number of Rows: Plugin; Number of Pins: 2P; Color: Black
C11-C14 = GRM155R60J106ME44D: Capacitance: Tolerance:±20% Tolerance:±20% Voltage Rated: Temperature Coefficient:; LCSC Part Name: 10uF ±20% 6.3V; Supplier Part: C76991; Manufacturer: muRata(村田); Supplier Footprint: 0402; JLCPCB Part Class: Extended Part; Datasheet: https://atta.szlcsc.com/upload/public/pdf/source/20200305/C490387_23319AE8C154DEB24C505E6C82A8106A.pdf; Supplier: LCSC; Tolerance: ±20%
C15 = JMK105BBJ475MV-F: Capacitance: Tolerance:±20% Tolerance:±20% Voltage Rated: Temperature Coefficient:; LCSC Part Name: 4.7uF ±20% 6.3V; Supplier Part: C87147; Manufacturer: TAIYO YUDEN(太诱); Supplier Footprint: 0402; JLCPCB Part Class: Extended Part; Datasheet: https://atta.szlcsc.com/upload/public/pdf/source/20210525/C2802164_C0429B055888A674C3F00BA74B841C5B.pdf; Supplier: LCSC; Tolerance: ±20%
C23 = C3216X5R1E476M160AC: Capacitance: Tolerance:±20% Tolerance:±20% Voltage Rated: Temperature Coefficient:; LCSC Part Name: 47uF ±20% 25V; Supplier Part: C2167787; Manufacturer: TDK; Supplier Footprint: 1206; JLCPCB Part Class: Extended Part; Datasheet: https://atta.szlcsc.com/upload/public/pdf/source/20210430/12912E3792F621391F28022904E5A4A4.pdf; Supplier: LCSC; Tolerance: ±20%
C30 C31 = 10F: Supplier Part: 581-SCCT20B106PRB; Supplier: Mouser; Manufacturer: AVX; Manufacturer Part: SCCT20B106PRB; Link: https://www.mouser.com/datasheet/2/40/AVX-SCC-1018831.pdf
D1 = FSV1045V: Supplier: LCSC; Supplier Part: C895433; Manufacturer: onsemi(安森美); JLCPCB Part Class: Extended Part
D2 = SM6T6V8A: Supplier: LCSC; Supplier Part: C84316; Manufacturer: ST(意法半导体); JLCPCB Part Class: Extended Part
D3 D19 = STPS3H100U: Forward Voltage (Vf@If):840mV@3A Reverse Voltage (Vr):100V Average Rectified Current (Io):3A Reverse Leakage Current (Ir):1uA@100V; LCSC Part Name: 电压:100V 电流:3A; Supplier Part: C283521; Manufacturer: ST(意法半导体); Supplier Footprint: SMB; JLCPCB Part Class: Extended Part; Datasheet: https://atta.szlcsc.com/upload/public/pdf/source/20181022/C283521_49DF33C1F0BFD183278876FE1ED2D806.pdf; Supplier: LCSC; Forward Voltage (Vf@If): 840mV@3A; Reverse Voltage (Vr): 100V; Average Rectified Current (Io): 3A; Reverse Leakage Current (Ir): 1uA@100V
L1 = 2.2uH: Supplier: LCSC; Supplier Part: C2041613; Manufacturer: muRata(村田); Manufacturer Part: 1285AS-H-2R2M=P2; JLCPCB Part Class: Extended Part
L7 = XGL4020-222MEC: Inductance: Tolerance:±20% Tolerance:±20% Saturation Current (Isat):6.2A DC Resistance (DCR): Ratings:AEC-Q200; LCSC Part Name: 2.2uH ±20% 6.2A; Supplier Part: C6012410; Manufacturer: Coilcraft(线艺); Supplier Footprint: 1616; JLCPCB Part Class: Extended Part; Datasheet: https://atta.szlcsc.com/upload/public/pdf/source/231023/xgl4020-3a114aaf374001a9337ca5718a01a6f3.pdf; Supplier: LCSC; Tolerance: ±20%; Saturation Current (Isat): 6.2A; Ratings: AEC-Q200
R18 = RC0402JR-0710ML: Type:Thick Film Resistors Resistance: Tolerance:±5% Tolerance:±5% Power(Watts): Overload Voltage (Max): Temperature Coefficient:±100ppm/℃ Temperature Coefficient:±100ppm/℃ Operating Temperature Range:-55℃~+155℃ Operating Temperature Range:-55℃~+155℃; LCSC Part Name: 厚膜电阻 10MΩ ±5% 62.5mW; Supplier Part: C274900; Manufacturer: YAGEO(国巨); Supplier Footprint: 0402; JLCPCB Part Class: Extended Part; Datasheet: https://atta.szlcsc.com/upload/public/pdf/source/20180821/C275644_0D56F95EFF785E7D9A1FEF436B37DA78.pdf; Supplier: LCSC; Type: Thick Film Resistors; Tolerance: ±5%; Temperature Coefficient: ±100ppm/℃; Operating Temperature Range: -55℃~+155℃
R19 = 0402WGF8202TCE: Type:Thick Film Resistors Resistance:82kΩ Tolerance:±1% Tolerance:±1% Power(Watts): Overload Voltage (Max): Temperature Coefficient:±100ppm/℃ Temperature Coefficient:±100ppm/℃ Operating Temperature Range:-55℃~+155℃ Operating Temperature Range:-55℃~+155℃; LCSC Part Name: 82kΩ ±1% 62.5mW 厚膜电阻; Supplier Part: C4142; Manufacturer: UNI-ROYAL(厚声); Supplier Footprint: 0402; JLCPCB Part Class: Extended Part; Datasheet: https://atta.szlcsc.com/upload/public/pdf/source/20200306/C422600_1E6D84923E4A46A82E41ADD87F860B5C.pdf; Supplier: LCSC; Type: Thick Film Resistors; Tolerance: ±1%; Temperature Coefficient: ±100ppm/℃; Operating Temperature Range: -55℃~+155℃
SW1 = M.sw.: license: https://www.gnu.org/licenses/lgpl-2.1.html
U3 = TPS62748YFPT: Supplier: LCSC; Manufacturer: TI(德州仪器); Supplier Part: C133949; JLCPCB Part Class: Extended Part
U9 = MAX17225ELT+T: Supplier: LCSC; Supplier Part: C2071569; Manufacturer: ADI(亚德诺)/MAXIM(美信); JLCPCB Part Class: Extended Part
C25-C27 = CC0402JRNPO9BN330: Capacitance: Tolerance:±5% Tolerance:±5% Voltage Rated: Temperature Coefficient:; LCSC Part Name: 33pF ±5% 50V; Supplier Part: C107005; Manufacturer: YAGEO(国巨); Supplier Footprint: 0402; JLCPCB Part Class: Extended Part; Datasheet: https://atta.szlcsc.com/upload/public/pdf/source/20181008/C309499_21CC21451B82C39E3D92150FD6B30293.pdf; Supplier: LCSC; Tolerance: ±5%
D4 = CESDLC5V0M5: polarity:Bi-Directional Reverse Stand-Off Voltage (Vrwm):5V Maximum Clamping Voltage:13V Peak Pulse Current (Ipp)@10/1000us:2.5A Breakdown Voltage:6.2V Type:ESD; LCSC Part Name: 双向ESD; Supplier Part: C119071; Manufacturer: CJ(江苏长电/长晶); Supplier Footprint: SOT-563; JLCPCB Part Class: Extended Part; Datasheet: https://atta.szlcsc.com/upload/public/pdf/source/20170717/C119071_1500269972586820776.pdf; Supplier: LCSC; polarity: Bi-Directional; Reverse Stand-Off Voltage (Vrwm): 5V; Maximum Clamping Voltage: 13V; Peak Pulse Current (Ipp)@10/1000us: 2.5A; Breakdown Voltage: 6.2V; Type: ESD
NSIM1 = SMN-305: Card Connection Mode:Clamshell Card Type:NanoSIM卡 Connector Type:Deck Body Height (Max):1.4mm Contact Material:Phosphor coppe Contact Plating:Gold Operating Temperature Range:-25℃~+85℃ Operating Temperature Range:-25℃~+85℃ Soldering Temperature(Max):260℃; LCSC Part Name: 翻盖式 NanoSIM卡 卡座; Supplier Part: C266890; Manufacturer: XUNPU(讯普); Supplier Footprint: SMD; JLCPCB Part Class: Extended Part; Datasheet: https://atta.szlcsc.com/upload/public/pdf/source/20201231/C266890_AC9AEDEE27E91F42B31BC81B42E52BE3.pdf; Supplier: LCSC; Card Connection Mode: Clamshell; Card Type: NanoSIM卡; Connector Type: Deck; Body Height (Max): 1.4mm; Contact Material: Phosphor coppe; Contact Plating: Gold; Operating Temperature Range: -25℃~+85℃; Soldering Temperature(Max): 260℃
R27-R29 R38-R41 = 0402WGF220JTCE: Type:Thick Film Resistors Resistance:22Ω Tolerance:±1% Tolerance:±1% Power(Watts): Overload Voltage (Max): Temperature Coefficient:±100ppm/℃ Temperature Coefficient:±100ppm/℃ Operating Temperature Range:-55℃~+155℃ Operating Temperature Range:-55℃~+155℃; LCSC Part Name: 22Ω ±1% 62.5mW 厚膜电阻; Supplier Part: C25092; Manufacturer: UNI-ROYAL(厚声); Supplier Footprint: 0402; JLCPCB Part Class: Basic Part; Datasheet: https://atta.szlcsc.com/upload/public/pdf/source/20200306/C422600_1E6D84923E4A46A82E41ADD87F860B5C.pdf; Supplier: LCSC; Type: Thick Film Resistors; Tolerance: ±1%; Temperature Coefficient: ±100ppm/℃; Operating Temperature Range: -55℃~+155℃
R30 = 0402WGF1502TCE: Type:Thick Film Resistors Resistance:15kΩ Tolerance:±1% Tolerance:±1% Power(Watts): Overload Voltage (Max): Temperature Coefficient:±100ppm/℃ Temperature Coefficient:±100ppm/℃ Operating Temperature Range:-55℃~+155℃ Operating Temperature Range:-55℃~+155℃; LCSC Part Name: 15kΩ ±1% 62.5mW 厚膜电阻; Supplier Part: C25756; Manufacturer: UNI-ROYAL(厚声); Supplier Footprint: 0402; JLCPCB Part Class: Basic Part; Datasheet: https://atta.szlcsc.com/upload/public/pdf/source/20200306/C422600_1E6D84923E4A46A82E41ADD87F860B5C.pdf; Supplier: LCSC; Type: Thick Film Resistors; Tolerance: ±1%; Temperature Coefficient: ±100ppm/℃; Operating Temperature Range: -55℃~+155℃
R32 R33 R36 R37 = 0402WGF5101TCE: Type:Thick Film Resistors Resistance:5.1kΩ Tolerance:±1% Tolerance:±1% Power(Watts): Overload Voltage (Max): Temperature Coefficient:±100ppm/℃ Temperature Coefficient:±100ppm/℃ Operating Temperature Range:-55℃~+155℃ Operating Temperature Range:-55℃~+155℃; LCSC Part Name: 5.1kΩ ±1% 62.5mW 厚膜电阻; Supplier Part: C25905; Manufacturer: UNI-ROYAL(厚声); Supplier Footprint: 0402; JLCPCB Part Class: Basic Part; Datasheet: https://atta.szlcsc.com/upload/public/pdf/source/20200306/C422600_1E6D84923E4A46A82E41ADD87F860B5C.pdf; Supplier: LCSC; Type: Thick Film Resistors; Tolerance: ±1%; Temperature Coefficient: ±100ppm/℃; Operating Temperature Range: -55℃~+155℃
U16 = CH340E: Applications Function:Transceiver Protocol: Supply Voltage:3.3V；5V Supply Voltage:3.3V；5V Data Rate:2Mbps; LCSC Part Name: USB转串口芯片 CH340; Supplier Part: C99652; Manufacturer: WCH(南京沁恒); Supplier Footprint: MSOP-10; JLCPCB Part Class: Extended Part; Datasheet: https://atta.szlcsc.com/upload/public/pdf/source/20230530/6E401E9554E9F5311886CC8B3F89B62E.pdf; Supplier: LCSC; Applications Function: Transceiver; Supply Voltage: 3.3V；5V; Data Rate: 2Mbps
U18 = YLED0402Y: LCSC Part Name: 发光管; Supplier Part: C20608782; Manufacturer: YONGYUTAI(永裕泰); Supplier Footprint: 0402; JLCPCB Part Class: Extended Part; Datasheet: https://atta.szlcsc.com/upload/public/pdf/source/20240119/E1996C4BAD90A29F1F2A68BBFD6A1841.pdf; Supplier: LCSC
U19 = YLED0402G: LCSC Part Name: 发光管; Supplier Part: C20608784; Manufacturer: YONGYUTAI(永裕泰); Supplier Footprint: 0402; JLCPCB Part Class: Extended Part; Datasheet: https://atta.szlcsc.com/upload/public/pdf/source/20240119/2792316D86947EC95655E09EC4742546.pdf; Supplier: LCSC
USB_ART USB_NOTE = TYPE-C 16PLT-H10.0: Connector Type:Type-C Standard:- Gender:Female Number of Ports:1 Number of Contacts:16P Mounting Style:Brick nogging Current Rating - Power (Max):5A Contact Material:- Contact Plating:- Operating Temperature Range:-40℃~+85℃ Operating Temperature Range:-40; LCSC Part Name: Type-C 母 立贴; Supplier Part: C3151749; Manufacturer: SHOU HAN(首韩); Supplier Footprint: SMD; JLCPCB Part Class: Extended Part; Datasheet: https://atta.szlcsc.com/upload/public/pdf/source/20220627/29253729C3C7BA78ED37A3D91B55CE65.pdf; Supplier: LCSC; Connector Type: Type-C; Gender: Female; Number of Ports: 1; Number of Contacts: 16P; Mounting Style: Brick nogging; Current Rating - Power (Max): 5A; Operating Temperature Range: -40℃~+85℃

## Nets
1V8: C10.1 C12.1 C13.1 C14.1 L1.1 L7.2 TP1.1 U3.C2(VOS) U9.5(IN) U9.6(EN)
+3V3: C3.1 C4.2 C9.1 C11.1 C20.2 C28.1 C29.1 C33.1 C34.1 F1.2 R2.2 R3.2 R4.2 R5.2 R6.2 R7.2 R8.2 R9.2 R10.2 R11.2 R12.2 R14.2 R34.2 R35.2 TP2.1 U2.5(VDD_IO) U2.8(VDD) U5.36(VDD) U5.37(VDD) U7.1 U9.1(OUT) U13.2(VCC) U16.7(VCC) U16.10(V3) USD1.4(VDD)
GND: BAT2.2 BAT5.2 C1.2 C2.2 C3.2 C4.1 C7.2 C8.2 C9.2 C10.2 C11.2 C12.2 C13.2 C14.2 C15.1 C16.1 C18.1 C20.1 C23.1 C24.2 C25.1 C26.1 C27.1 C28.2 C29.2 C31.2 C33.2 C34.2 CN1.0(MOUNTING) CN1.3(GND) CN1.5(GND) CN1.6(GND) CN1.11(GND) CN1.18(GND) CN1.33(GND) CN1.39(GND) CN1.45(GND) CN1.51(GND) CN1.57(GND) CN1.71(GND) CN1.73(GND) CN1.76 CN1.77 D2.2(A) D4.2 E1.2 L5.2 L6.2 NSIM1.1(EP) NSIM1.2(EP) NSIM1.3(EP) NSIM1.4(EP) NSIM1.C5(GND) R19.1 R24.1 R31.2 R32.1 R33.1 R36.1 R37.1 R42.1 R43.1 SW1.1 U2.1(SDO/SA0) U2.6(GND) U2.7(GND) U3.B2(GND) U3.D1(CTRL) U5.1(GND) U5.22(GND) U5.38(GND) U5.39(GND) U5.47(GND) U5.59(GND) U7.3 U7.5 U7.9 U9.3(GND) U11.2 U11.3 U11.4 U12.2 U12.3 U12.4 U13.1(GND) U13.4(GNDRF) U16.3(GND) USB_ART.0(EH) USB_ART.A1(GND) USB_ART.A8(SBU1) USB_ART.A12(GND) USB_ART.B1(GND) USB_ART.B8(SBU2) USB_ART.B12(GND) USB_NOTE.0(EH) USB_NOTE.A1(GND) USB_NOTE.A8(SBU1) USB_NOTE.A12(GND) USB_NOTE.B1(GND) USB_NOTE.B8(SBU2) USB_NOTE.B12(GND) USD1.6(VSS) USD1.10(GND) USD1.11(GND) USD1.12(GND) USD1.13(GND)
VBAT: BAT2.1 BAT5.1 C30.1 D1.1(A) D1.2(A)
BOOT: C36.1 R42.2 U5.7(~BOOT)
CC1_ART: R32.2 USB_ART.A5(CC1)
CC1_NOTE: R36.2 USB_NOTE.A5(CC1)
CC2_ART: R33.2 USB_ART.B5(CC2)
CC2_NOTE: R37.2 USB_NOTE.B5(CC2)
I_CS: R2.1 U2.12(CS)
I_SCL: R3.1 U2.13(SCL) U5.53(~D42)
I_SDA: R4.1 U2.14(SDA) U5.52(~D43)
NC_SCL: CN1.40(SCL_P) R5.1 U5.4(~D39)
NC_SDA: CN1.42(SDA_P) R6.1 U5.5(D40)
NRESET: C7.1 CN1.50(AUX3) R14.1 U5.50(nRESET) U7.10
PT_CS: U5.56(D38)
RTS: C36.2 U16.4(RTS#)
SD_CD: R7.1 U5.14(~AD35) USD1.2(CD/DAT3)
SD_MISO: R9.1 U5.23(MISO ~D6) USD1.7(DAT0)
SD_MOSI: R8.1 U5.13(MOSI ~D7) USD1.3(CMD)
SD_SCK: R11.1 U5.12(SCLK ~D5) USD1.5(CLK)
SIM_CLK: CN1.14(SIM_CLK) R28.1
SIM_DAT2: R12.1 USD1.1(DAT2)
SIM_IO: CN1.12(SIM_IO) R27.1
SIM_RST: CN1.10(SIM_RST) R29.1
SIM_VCC: C24.1 CN1.8(SIM_VCC) D4.6 NSIM1.C1(VCC) R30.2
SWDCLK: U5.2(D20 SWDCK) U7.4
SWDIO: U5.10(D21 SWDIO) U7.2
SWO: AD33.1 U5.30(~AD33) U7.6
USB_RX_ART: U5.3(~D49 RX0) U16.9(RXD) U19.2(K)
USB_TX_ART: U5.9(~D48 TX0) U16.8(TXD) U18.2(K)
USBD+: CN1.7(USB_DP) R41.1
USBD-: CN1.9(USB_DN) R40.1
VACT_GPS_OUT: CN1.20(VACT_GPS_OUT) R23.2
VMAIN: C15.2 C23.2 D1.3(K) D2.1(C) D3.1(K) D19.1(K) F2.2 R18.2 U3.A2(VIN) U3.C1(VSEL)
VUSB: CN1.13(VUSB) D3.2(A) USB_NOTE.A4(VBUS) USB_NOTE.A9(VBUS) USB_NOTE.B4(VBUS) USB_NOTE.B9(VBUS)
VUSB_ART: D19.2(A) USB_ART.A4(VBUS) USB_ART.A9(VBUS) USB_ART.B4(VBUS) USB_ART.B9(VBUS)
$1N5: CN1.70(VMODEM_P) CN1.72(VMODEM_P) CN1.74(VMODEM_P) F2.1
$1N27: CN1.16(SIM_NPRESENT) R31.1
$1N1900: U12.1 U13.3(AO)
$1N1978: C19.2 E1.4
$1N2069: L3.1 U13.5(AI)
$1N2072: C17.1 L3.2
$1N2075: C17.2 R22.1
$1N2105: C18.2 C19.1 R22.2
$1N2207: R23.1 R24.2 U13.6(PON)
$1N3253: R20.1 U11.1
$1N3261: R20.2 R21.1
$1N3308: L2.2 U14.1
$1N3573: R26.2 U14.6
$1N3674: C22.1 L4.1 U14.2
$1N3697: C16.2 C21.1 L5.1 R21.2
$1N3711: C21.2 L2.1 L6.1
$1N3824: CN1.2(VIO_P) CN1.4(VIO_P) F1.1
$1N9740: C22.2 L4.2 U14.3
$1N9751: R26.1 U14.5
$2N19158: R10.1 USD1.8(DAT1)
$3N3: C2.1 U5.34(XO) U6.2(GND)
$3N4: C1.1 U5.35(XI) U6.1
$3N3757: AD11.1 U5.32(~AD11)
$3N3767: AD12.1 U5.26(~AD12)
$3N3770: AD13.1 U5.28(~AD13)
$3N3773: AD29.1 U5.33(~AD29)
$3N3776: AD32.1 U5.24(~AD32)
$3N3779: D18.1 U5.41(~D18)
$4N6: L1.2 U3.A1(SW)
$4N11: L7.1 U9.2(LX)
$4N1576: R19.2 U9.4(SEL)
$4N2482: C8.1 R18.1 SW1.2 U3.B1(EN)
$4N17108: C30.2 C31.1
$5N5765: C25.2 D4.5 NSIM1.C2(RST) R29.2
$5N5772: C26.2 D4.4 NSIM1.C3(CLK) R28.2
$5N5779: C27.2 D4.3 NSIM1.C7(I/O) R27.2 R30.1
$5N13425: R34.1 U19.1(A)
$5N13426: R35.1 U18.1(A)
$5N13679: R41.2 USB_NOTE.A6(DP1) USB_NOTE.B6(DP2)
$5N13680: R40.2 USB_NOTE.A7(DN1) USB_NOTE.B7(DN2)
$5N13766: R38.1 U16.2(UD-)
$5N13775: R38.2 USB_ART.A7(DN1) USB_ART.B7(DN2)
$5N13822: R39.2 USB_ART.A6(DP1) USB_ART.B6(DP2)
$5N13825: R39.1 U16.1(UD+)

Not connected (* = marked no-connect by the designer): CN1 1(NC)* 15(NC)* 17(NC)* 19(NC)* 21(NC)* 22(VACT_GPS_IN)* 23(NC)* 32(NC)* 34(NC)* 35(NC)* 36(NC)* 37(NC)* 38(AUX5)* 41(NC)* 43(NC)* 44(NC)* 46(AUX1)* 47(NC)* 48(AUX2)* 49(NC)* 52(AUX4)* 53(NC)* 54(ATTN_P)* 55(NC)* 56(AUX_EN_P)* 58(AUX_RX_P)* 59(NC)* 60(AUX_TX_P)* 61(NC)* 62(RX_P)* 63(NC)* 64(TX_P)* 65(NC)* 66(NC)* 67(NRST)* 68(NC)* 69(NC)* 75(NC)*; D4 1*; E1 3*; NSIM1 C6(Vpp)*; R43 2*; U2 2(SDX)* 3(SCX)* 4(INT1)* 9(INT2)* 10(OCS_AUX)* 11(SDO_AUX)*; U3 D2(LOAD)*; U5 6(SDA D9)* 8(D10)* 11(SCL D8)* 15(~D4)* 16(~D24)* 17(~D22)* 18(~D23)* 19(~D27)* 20(D14)* 21(~D28)* 25(~D25)* 27(~D26)* 29(D15)* 31(AD34)* 40(~D19)* 42(AD16)* 43(D17)* 44(~AD31)* 45(D41)* 46(~D45)* 48(D2)* 49(D1)* 51(D0)* 54(D3)* 55(D36)* 57(~D37)* 58(~D44)*; U7 7* 8*; U14 4* 7*; U16 5(CTS#)* 6(TNOW)*; USD1 9(CD)*

## Notes on the sheets
sheet 1
- LTE
- VIO on Notecarrier supplies VCC on the rest of the components.
- Notecard can pulse AUX3 low to reset Artemis.
- GPS
sheet 2
- SD card
- DI
- DO
sheet 3
- JTAG / SWD debug & programmer
